# Altium project ESP32_DevBoard_T.PrjPcb
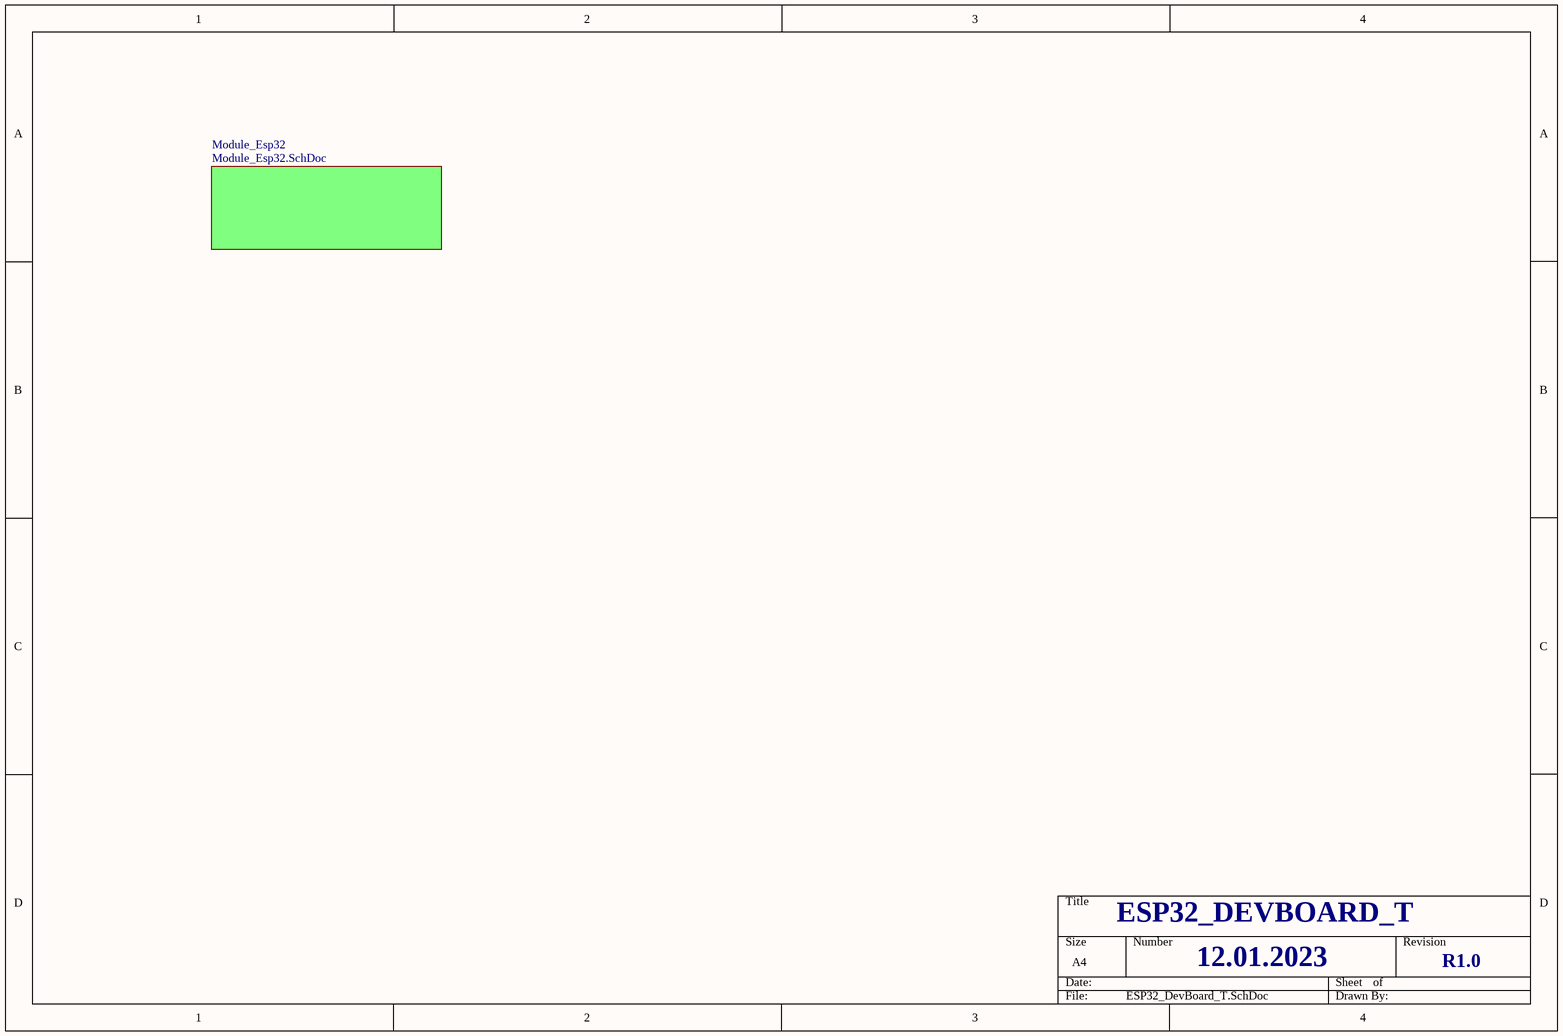
[diagram p0: ESP32_DevBoard_T.SchDoc]
7 sheets, 62 parts. Net scope: flat (ports and power ports of the same name join across sheets).
Board file: ESP32_DevBoard_T.PcbDoc
Sheets:
  ESP32_DevBoard_T.SchDoc
    Module_Esp32 = Module_Esp32.SchDoc
  Input_Analog.SchDoc
  Connector.SchDoc
  Peripheral.SchDoc
  Communication.SchDoc
  Output_Analog.SchDoc

## Sheet ESP32_DevBoard_T.SchDoc
size A4

### Sub-sheets
Module_Esp32 = Module_Esp32.SchDoc: no entries

### Notes on the sheet
- ESP32_DEVBOARD_T
- 12.01.2023
- R1.0

## Sheet Module_Esp32.SchDoc
size A4
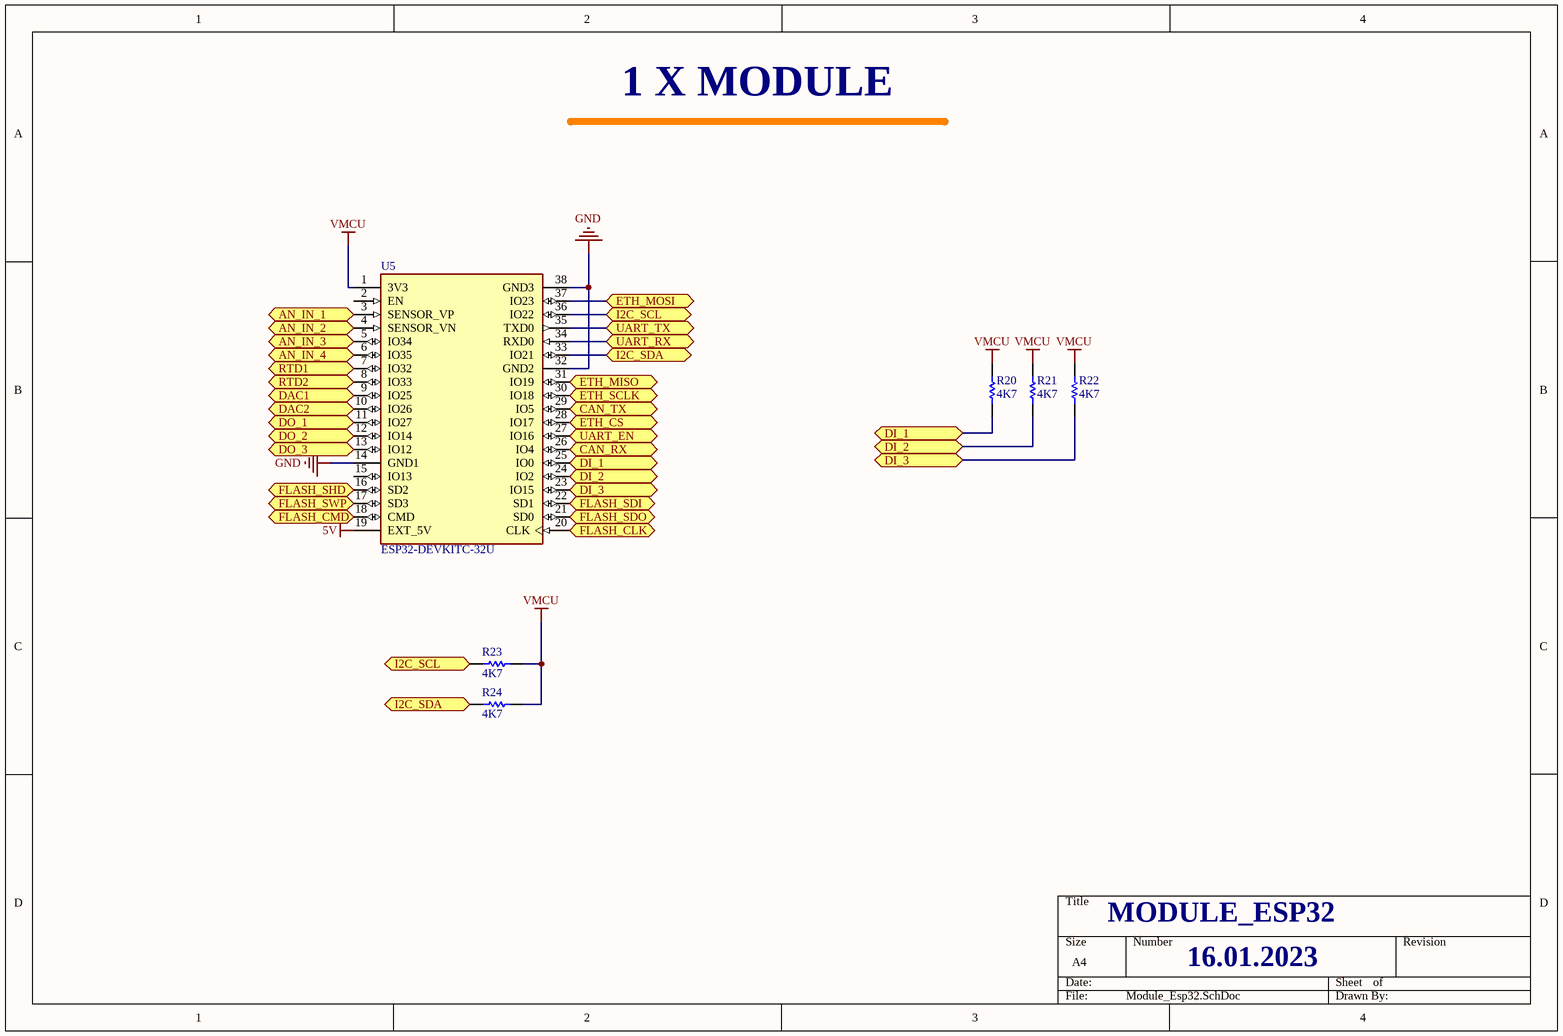
[diagram p1: Module_Esp32.SchDoc]

### Parts
R20  4K7  [RES1608[0603]]
R21  4K7  [RES1608[0603]]
R22  4K7  [RES1608[0603]]
R23  4K7  [RES1608[0603]]
R24  4K7  [RES1608[0603]]
U5  ESP32-DEVKITC-32U  [MODULE_ESP32-DEVKITC-32U]

### Ports
AN_IN_1, AN_IN_2, AN_IN_3, AN_IN_4, CAN_RX, CAN_TX, DAC1, DAC2, DI_1, DI_2, DI_3, DO_1, DO_2, DO_3, ETH_CS, ETH_MISO, ETH_MOSI, ETH_SCLK, FLASH_CLK, FLASH_CMD, FLASH_SDI, FLASH_SDO, FLASH_SHD, FLASH_SWP, I2C_SCL, I2C_SDA, RTD1, RTD2, UART_EN, UART_RX, UART_TX

### Nets
5V: U5.19(EXT_5V)
GND: U5.14(GND1) U5.32(GND2) U5.38(GND3)
VMCU: R20.1 R21.1 R22.1 R23.1 R24.1 U5.1(3V3)
NetC4_1: U5.3(SENSOR_VP) ; port AN_IN_1
NetC5_1: U5.4(SENSOR_VN) ; port AN_IN_2
NetC6_1: U5.7(IO32) ; port RTD1
NetC8_1: U5.8(IO33) ; port RTD2
NetH1_3: U5.37(IO23) ; port ETH_MOSI
NetH1_4: U5.30(IO18) ; port ETH_SCLK
NetH1_5: U5.28(IO17) ; port ETH_CS
NetH1_12: U5.31(IO19) ; port ETH_MISO
NetP2_7: U5.12(IO14) ; port DO_2
NetP2_8: U5.11(IO27) ; port DO_1
NetP2_9: R21.2 U5.24(IO2) ; port DI_2
NetP2_10: U5.13(IO12) ; port DO_3
NetP2_11: R22.2 U5.23(IO15) ; port DI_3
NetP2_12: R20.2 U5.25(IO0) ; port DI_1
NetR23_2: R23.2 U5.36(IO22) ; port I2C_SCL
NetR24_2: R24.2 U5.33(IO21) ; port I2C_SDA
NetR29_1: U5.10(IO26) ; port DAC2
NetR30_1: U5.9(IO25) ; port DAC1
NetU1_1: U5.29(IO5) ; port CAN_TX
NetU1_4: U5.26(IO4) ; port CAN_RX
NetU2_1: U5.34(RXD0) ; port UART_RX
NetU2_2: U5.27(IO16) ; port UART_EN
NetU2_4: U5.35(TXD0) ; port UART_TX
NetU4_1: U5.6(IO35) ; port AN_IN_4
NetU4_6: U5.5(IO34) ; port AN_IN_3
NetU5_16: U5.16(SD2) ; port FLASH_SHD
NetU5_17: U5.17(SD3) ; port FLASH_SWP
NetU5_18: U5.18(CMD) ; port FLASH_CMD
NetU5_20: U5.20(CLK) ; port FLASH_CLK
NetU5_21: U5.21(SD0) ; port FLASH_SDO
NetU5_22: U5.22(SD1) ; port FLASH_SDI

Not connected (* = marked no-connect by the designer): U5 2(EN) 15(IO13)

### Notes on the sheet
- 1 X MODULE
- MODULE_ESP32
- 16.01.2023

### Library data of the parts
R20-R22 = RES: RESISTOR 0805 Case %1; Value: 430R; Published: 8-Jun-2000; LatestRevisionDate: 17-Jul-2002; LatestRevisionNote: Re-released for DXP Platform.; PackageReference: AXIAL-0.5; Publisher: Altium Limited
R23 R24 = RES: RESISTOR 0603 Case %1; Value: 430R; Published: 8-Jun-2000; LatestRevisionDate: 17-Jul-2002; LatestRevisionNote: Re-released for DXP Platform.; PackageReference: AXIAL-0.5; Publisher: Altium Limited
U5 = ESP32-DEVKITC-32U: ESP32-DEVKITC; Availability: Unavailable; MP: ESP32-DEVKITC-32U; Value: *; Package: None; Price: None

## Sheet Input_Analog.SchDoc
size A4
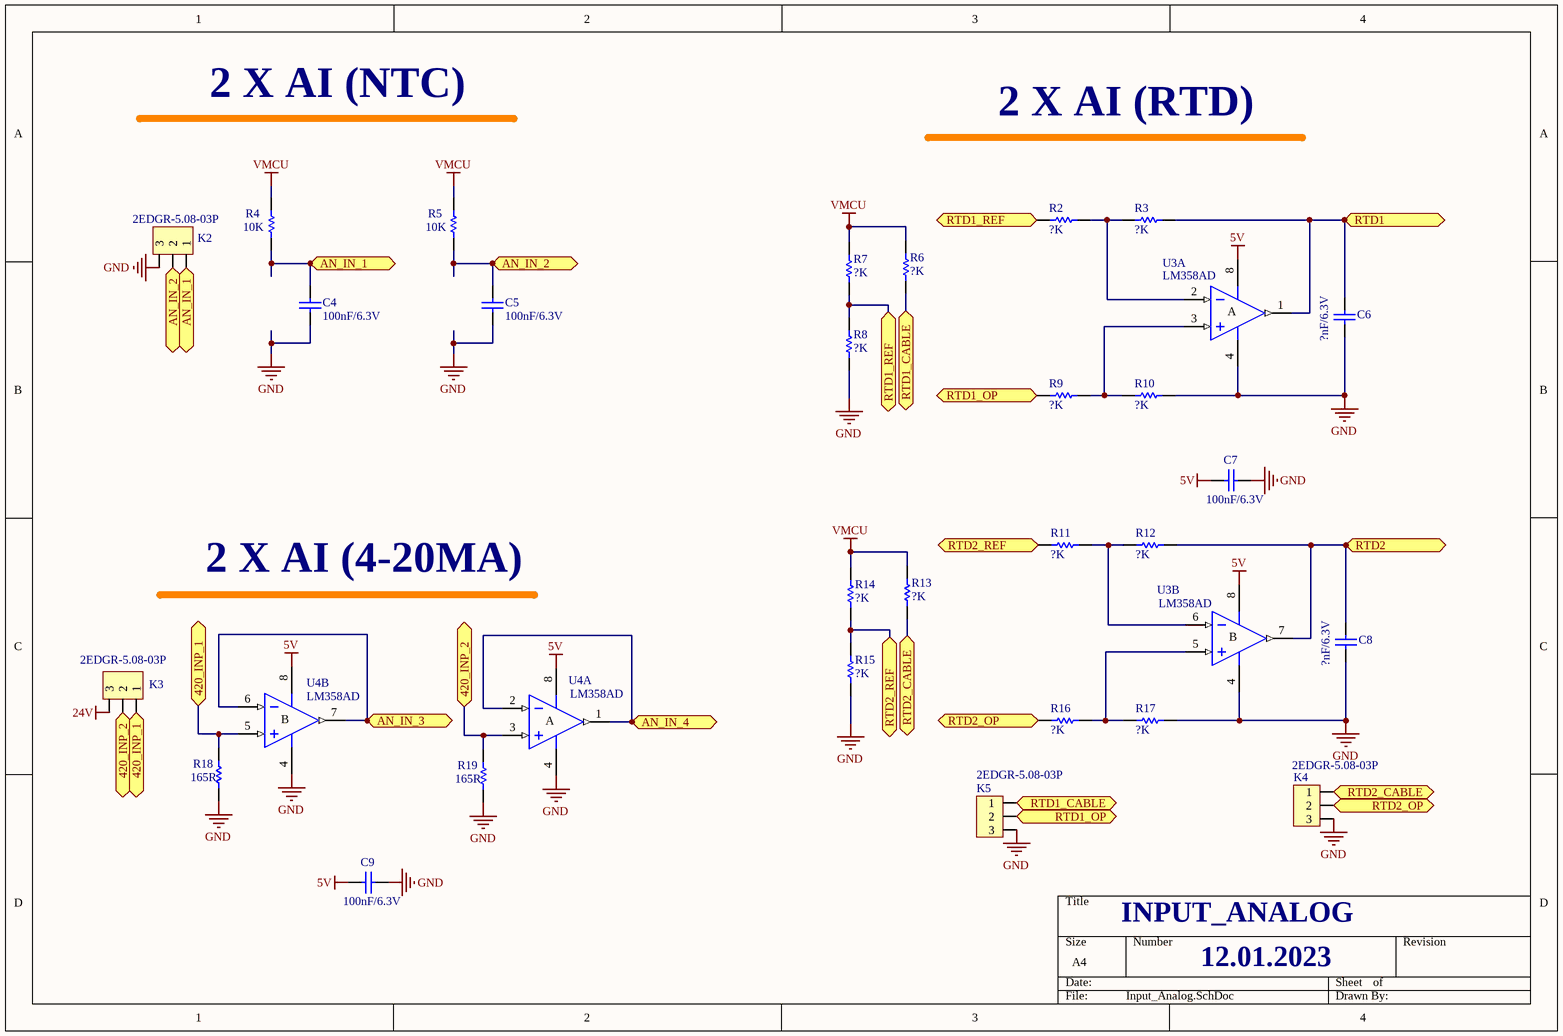
[diagram p2: Input_Analog.SchDoc]

### Parts
C4  100nF/6.3V  [CAP0603W]
C5  100nF/6.3V  [CAP0603W]
C6  ?nF/6.3V  [CAP0603W]
C7  100nF/6.3V  [CAP0603W]
C8  ?nF/6.3V  [CAP0603W]
C9  100nF/6.3V  [CAP0603W]
K2  2EDGR-5.08-03P  [CON_DG129_03P]
K3  2EDGR-5.08-03P  [CON_DG129_03P]
K4  2EDGR-5.08-03P  [CON_DG129_03P]
K5  2EDGR-5.08-03P  [CON_DG129_03P]
R2  ?K  [RES1608[0603]]
R3  ?K  [RES1608[0603]]
R4  10K  [RES1608[0603]]
R5  10K  [RES1608[0603]]
R6  ?K  [RES1608[0603]]
R7  ?K  [RES1608[0603]]
R8  ?K  [RES1608[0603]]
R9  ?K  [RES1608[0603]]
R10  ?K  [RES1608[0603]]
R11  ?K  [RES1608[0603]]
R12  ?K  [RES1608[0603]]
R13  ?K  [RES1608[0603]]
R14  ?K  [RES1608[0603]]
R15  ?K  [RES1608[0603]]
R16  ?K  [RES1608[0603]]
R17  ?K  [RES1608[0603]]
R18  165R  [RES1608[0603]]
R19  165R  [RES1608[0603]]
U3  LM358AD  [SO8]  (parts A,B of 2)
U4  LM358AD  [SO8]  (parts A,B of 2)

### Ports
420_INP_1, 420_INP_2, AN_IN_1, AN_IN_2, AN_IN_3, AN_IN_4, RTD1, RTD1_CABLE, RTD1_OP, RTD1_REF, RTD2, RTD2_CABLE, RTD2_OP, RTD2_REF

### Nets
5V: C7.1 C9.1 U3.8(V+) U4.8(V+)
24V: K3.3
GND: C4.2 C5.2 C6.2 C7.2 C8.2 C9.2 K2.3 K4.3 K5.3 R8.1 R10.1 R15.1 R17.1 R18.2 R19.2 U3.4(V-) U4.4(V-)
VMCU: R4.1 R5.1 R6.2 R7.2 R13.2 R14.2
NetC4_1: C4.1 K2.1 R4.2 ; port AN_IN_1
NetC5_1: C5.1 K2.2 R5.2 ; port AN_IN_2
NetC6_1: C6.1 R3.1 U3.1(OUT) ; port RTD1
NetC8_1: C8.1 R12.1 U3.7(OUT) ; port RTD2
NetK3_1: K3.1 R18.1 U4.5(IN+) ; port 420_INP_1
NetK3_2: K3.2 R19.1 U4.3(IN+) ; port 420_INP_2
NetK4_1: K4.1 R13.1 ; port RTD2_CABLE
NetK4_2: K4.2 R16.2 ; port RTD2_OP
NetK5_1: K5.1 R6.1 ; port RTD1_CABLE
NetK5_2: K5.2 R9.2 ; port RTD1_OP
NetR2_1: R2.1 R3.2 U3.2(IN-)
NetR2_2: R2.2 R7.1 R8.2 ; port RTD1_REF
NetR9_1: R9.1 R10.2 U3.3(IN+)
NetR11_1: R11.1 R12.2 U3.6(IN-)
NetR11_2: R11.2 R14.1 R15.2 ; port RTD2_REF
NetR16_1: R16.1 R17.2 U3.5(IN+)
NetU4_1: U4.1(OUT) U4.2(IN-) ; port AN_IN_4
NetU4_6: U4.6(IN-) U4.7(OUT) ; port AN_IN_3

### Notes on the sheet
- 2 X AI (NTC)
- 2 X AI (RTD)
- 2 X AI (4-20MA)
- INPUT_ANALOG
- 12.01.2023
- (in symbol LM358AD, part A) A
- (in symbol LM358AD, part B) B

### Library data of the parts
C4-C9 = CAP1: CAPACITOR 0603 Case; Value: 100nF; Published: 8-Jun-2000; LatestRevisionDate: 17-Jul-2002; LatestRevisionNote: Re-released for DXP Platform.; PackageReference: C1206; Publisher: Altium Limited
K2-K5 = KLEMENS_3P: CONNECTOR 5.08mm 3PIN 90DEG
R2-R19 = RES: RESISTOR 0603 Case %1; Value: 430R; Published: 8-Jun-2000; LatestRevisionDate: 17-Jul-2002; LatestRevisionNote: Re-released for DXP Platform.; PackageReference: AXIAL-0.5; Publisher: Altium Limited
U3 = LM358AD: OPAMP Low-Power Dual Operational Amplifier; Published: 24-Aug-2001; LatestRevisionDate: 13-Apr-2006; LatestRevisionNote: IPC-7351 Footprint Added.; DatasheetVersion: Jun-1998; PackageVersion: Dec-2002; PackageReference: SO8; Publisher: Altium Limited; PackageDescription: 8-Pin Small Outline Integrated Circuit 1.27 mm Pitch; Code_JEDEC: MS-012-AA; Code_IPC: SOIC127P600-8; ComponentLink1Description: Manufacturer Link; ComponentLink1URL: http://www.st.com/; ComponentLink2Description: Datasheet; ComponentLink2URL: http://www.st.com/stonline/products/literature/ds/2163/lm358.pdf
U4 = LM358AD: Low-Power Dual Operational Amplifier; Published: 24-Aug-2001; LatestRevisionDate: 13-Apr-2006; LatestRevisionNote: IPC-7351 Footprint Added.; DatasheetVersion: Jun-1998; PackageVersion: Dec-2002; PackageReference: SO8; Publisher: Altium Limited; PackageDescription: 8-Pin Small Outline Integrated Circuit 1.27 mm Pitch; Code_JEDEC: MS-012-AA; Code_IPC: SOIC127P600-8; ComponentLink1Description: Manufacturer Link; ComponentLink1URL: http://www.st.com/; ComponentLink2Description: Datasheet; ComponentLink2URL: http://www.st.com/stonline/products/literature/ds/2163/lm358.pdf

## Sheet Connector.SchDoc
size A4
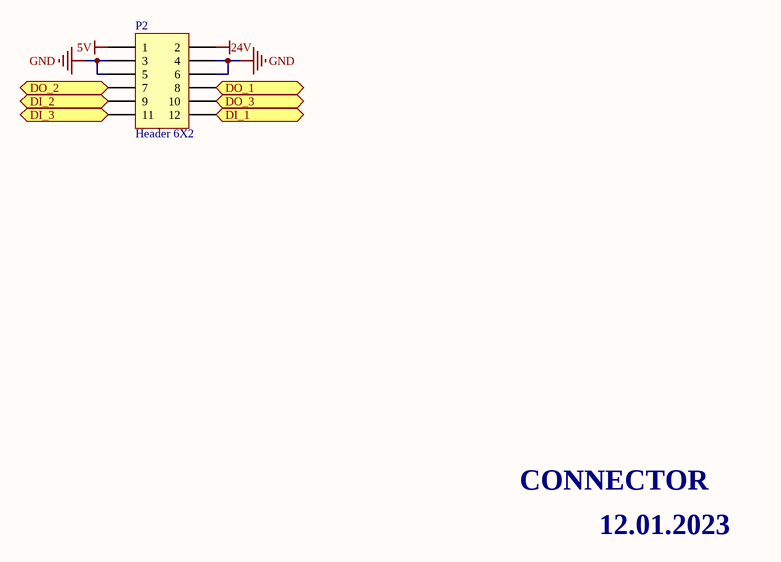
[diagram p3: Connector.SchDoc]

### Parts
P2  Header 6X2  [HDR2X6]

### Ports
DI_1, DI_2, DI_3, DO_1, DO_2, DO_3

### Nets
5V: P2.1
24V: P2.2
GND: P2.3 P2.4 P2.5 P2.6
NetP2_7: P2.7 ; port DO_2
NetP2_8: P2.8 ; port DO_1
NetP2_9: P2.9 ; port DI_2
NetP2_10: P2.10 ; port DO_3
NetP2_11: P2.11 ; port DI_3
NetP2_12: P2.12 ; port DI_1

### Notes on the sheet
- CONNECTOR
- 12.01.2023

### Library data of the parts
P2 = Header 6X2: CONNECTOR Header, 6-Pin, Dual row; LatestRevisionDate: 17-Jul-2002; LatestRevisionNote: Re-released for DXP Platform.; Publisher: Altium Limited

## Sheet Peripheral.SchDoc
size A4
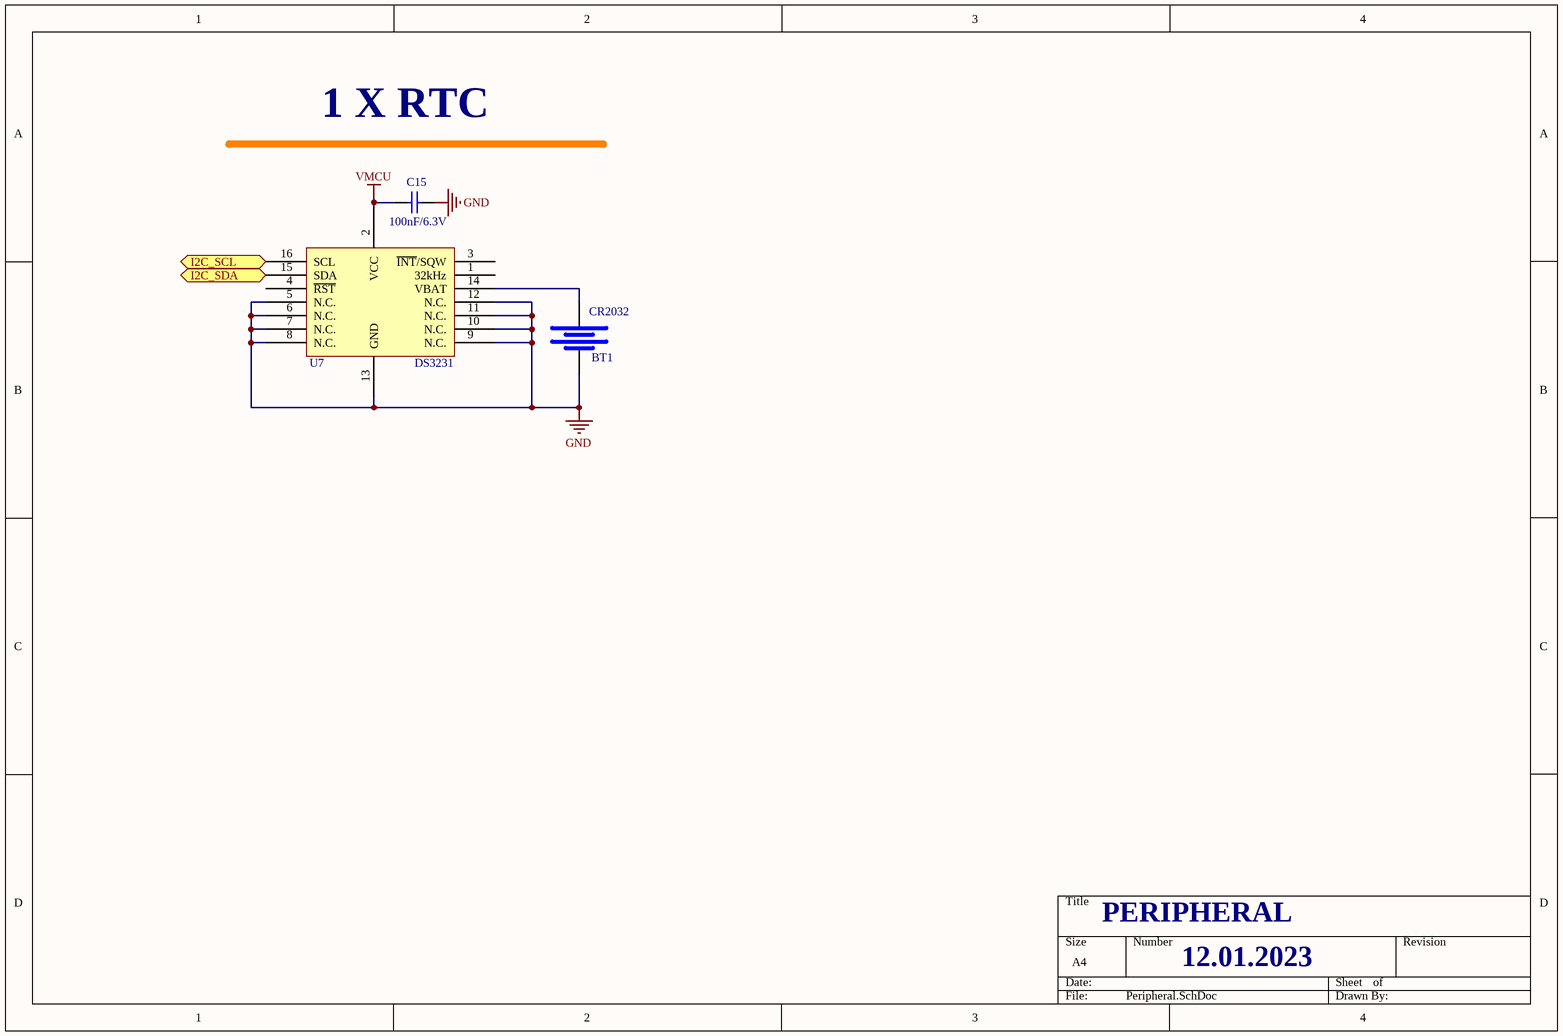
[diagram p4: Peripheral.SchDoc]

### Parts
BT1  CR2032  [CR2032]
C15  100nF/6.3V  [CAP0603W]
U7  DS3231  [SOIC16]

### Ports
I2C_SCL, I2C_SDA

### Nets
GND: BT1.2(-) C15.2 U7.5(N.C.) U7.6(N.C.) U7.7(N.C.) U7.8(N.C.) U7.9(N.C.) U7.10(N.C.) U7.11(N.C.) U7.12(N.C.) U7.13(GND)
VMCU: C15.1 U7.2(VCC)
NetBT1_1: BT1.1(+) U7.14(VBAT)
NetR23_2: U7.16(SCL) ; port I2C_SCL
NetR24_2: U7.15(SDA) ; port I2C_SDA

Not connected (* = marked no-connect by the designer): U7 1(32kHz) 3(~{INT}/SQW) 4(~{RST})

### Notes on the sheet
- 1 X RTC
- PERIPHERAL
- 12.01.2023

### Library data of the parts
BT1 = BATTERY_CR2032: BATTERY CR2032 HORIZONTAL 3PIN
C15 = CAP1: CAPACITOR 0603 Case; Value: 100nF; Published: 8-Jun-2000; LatestRevisionDate: 17-Jul-2002; LatestRevisionNote: Re-released for DXP Platform.; PackageReference: C1206; Publisher: Altium Limited
U7 = RTC_DS3231: IC DS3231SN RTC W/TCXO 16-SOIC MAXIM

## Sheet Communication.SchDoc
size A4
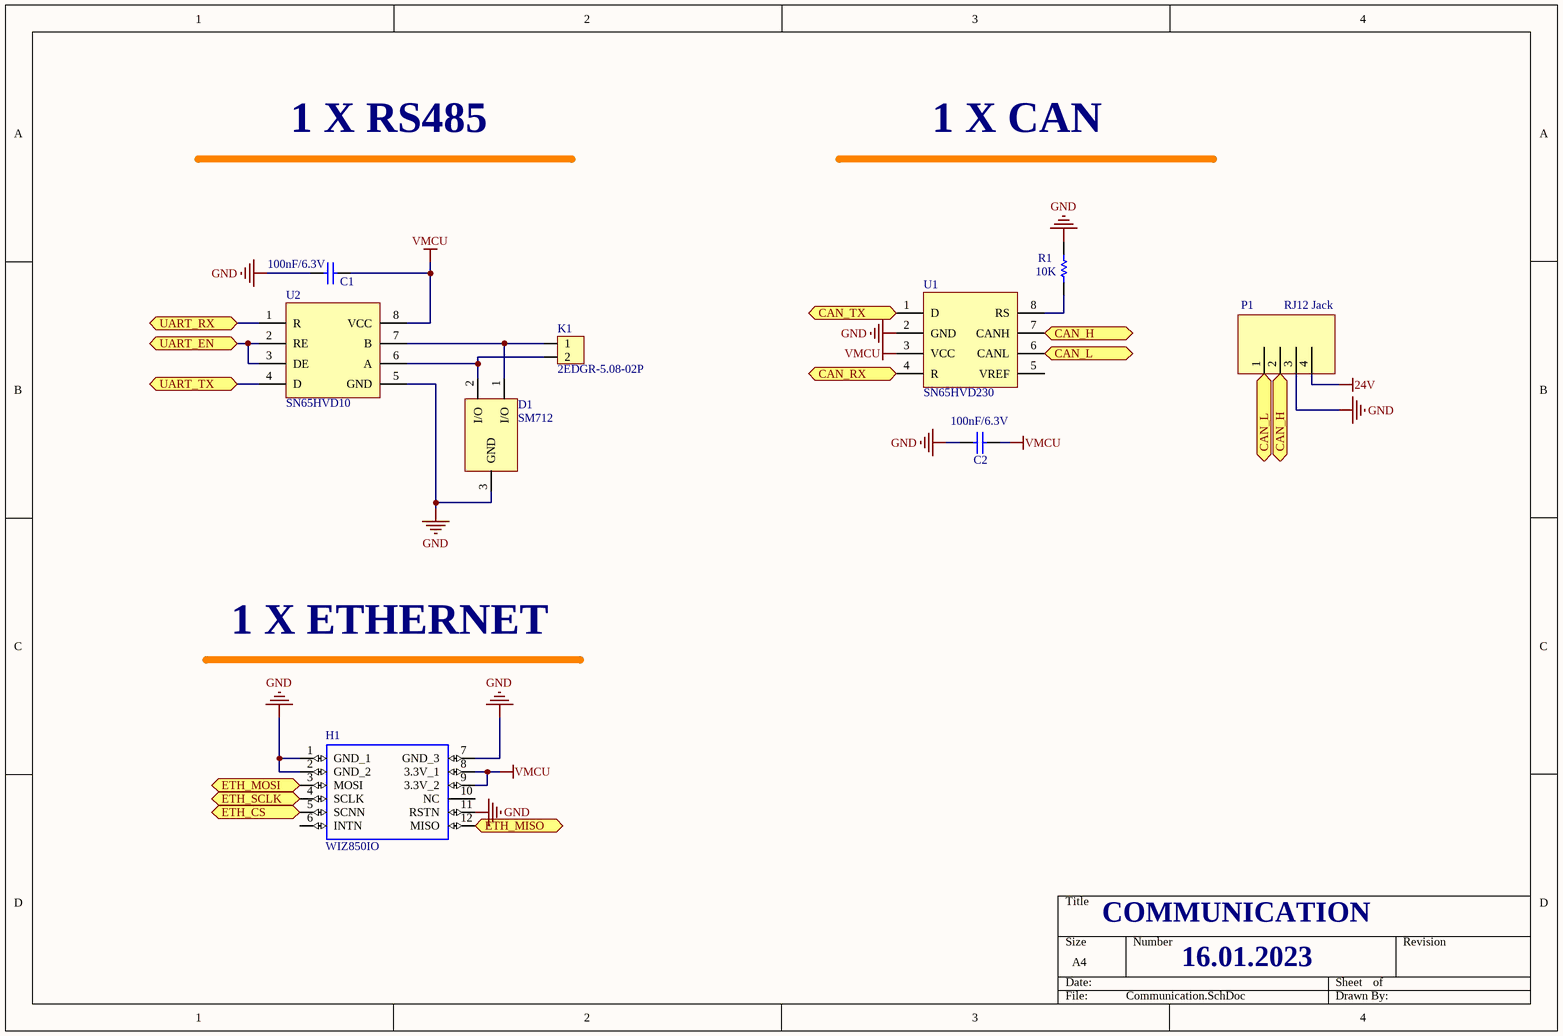
[diagram p5: Communication.SchDoc]

### Parts
C1  100nF/6.3V  [CAP0603W]
C2  100nF/6.3V  [CAP0603W]
D1  SM712  [SOT23 - BC8X6]
H1  WIZ850IO  [WIZ850IO]
K1  2EDGR-5.08-02P  [CON_DG129_02P]
P1  RJ12 Jack  [rj12_90deg_con_4p4c]
R1  10K  [RES1608[0603]]
U1  SN65HVD230  [SO8]
U2  SN65HVD10  [SO8]

### Ports
CAN_H, CAN_L, CAN_RX, CAN_TX, ETH_CS, ETH_MISO, ETH_MOSI, ETH_SCLK, UART_EN, UART_RX, UART_TX

### Nets
24V: P1.4
GND: C1.1 C2.1 D1.3(GND) H1.1(GND_1) H1.2(GND_2) H1.7(GND_3) H1.11(RSTN) P1.3 R1.1 U1.2(GND) U2.5(GND)
VMCU: C1.2 C2.2 H1.8(3.3V_1) H1.9(3.3V_2) U1.3(VCC) U2.8(VCC)
NetD1_1: D1.1(I/O) K1.1 U2.7(B)
NetD1_2: D1.2(I/O) K1.2 U2.6(A)
NetH1_3: H1.3(MOSI) ; port ETH_MOSI
NetH1_4: H1.4(SCLK) ; port ETH_SCLK
NetH1_5: H1.5(SCNN) ; port ETH_CS
NetH1_12: H1.12(MISO) ; port ETH_MISO
NetP1_1: P1.1 U1.6(CANL) ; port CAN_L
NetP1_2: P1.2 U1.7(CANH) ; port CAN_H
NetR1_2: R1.2 U1.8(RS)
NetU1_1: U1.1(D) ; port CAN_TX
NetU1_4: U1.4(R) ; port CAN_RX
NetU2_1: U2.1(R) ; port UART_RX
NetU2_2: U2.2(RE) U2.3(DE) ; port UART_EN
NetU2_4: U2.4(D) ; port UART_TX

Not connected (* = marked no-connect by the designer): H1 6(INTN) 10(NC); U1 5(VREF)

### Notes on the sheet
- 1 X RS485
- 1 X CAN
- 1 X ETHERNET
- COMMUNICATION
- 16.01.2023

### Library data of the parts
C1 C2 = CAP1: CAPACITOR 0603 Case; Value: 100nF; Published: 8-Jun-2000; LatestRevisionDate: 17-Jul-2002; LatestRevisionNote: Re-released for DXP Platform.; PackageReference: C1206; Publisher: Altium Limited
D1 = SM712: DIODE TVS Array For Rs485
H1 = WIZ850IO: Ethernet - 10/100 Base-T/TX PHY SPI Interface Module; MF: WIZnet; Value: *; Package: Module WIZnet; Availability: In Stock; Check_prices: https://www.snapeda.com/parts/WIZ850IO/WIZnet/view-part/?ref=eda; SnapEDA_Link: https://www.snapeda.com/parts/WIZ850IO/WIZnet/view-part/?ref=snap; Purchase-URL: https://pricing.snapeda.com/search/part/WIZ850IO/?ref=eda; MP: WIZ850IO; Price: None
K1 = KLEMENS_2P: CONNECTOR 5.08mm 2PIN 90DEG
P1 = RJ12_4P4C: CONNECTOR RJ12 Jack, 90 Degree
R1 = RES: RESISTOR 0603 Case %1; Value: 430R; Published: 8-Jun-2000; LatestRevisionDate: 17-Jul-2002; LatestRevisionNote: Re-released for DXP Platform.; PackageReference: AXIAL-0.5; Publisher: Altium Limited
U1 = SN65HVD230: CAN Interface IC 3.3V CAN Transceiver; Published: 24-Aug-2001; LatestRevisionDate: 6-Jun-2005; LatestRevisionNote: Stylized 3D Model Added.; DatasheetDocument: Feb-1998; PackageDocument: Aug-1999; PackageReference: SO8W; Publisher: Altium Limited; ComponentLink1Description: Manufacturer Link; ComponentLink1URL: http://www.st.com/
U2 = 75176: IC SN65HVD10DR SMD SOIC8; Published: 24-Aug-2001; LatestRevisionDate: 6-Jun-2005; LatestRevisionNote: Stylized 3D Model Added.; DatasheetDocument: Feb-1998; PackageDocument: Aug-1999; PackageReference: SO8W; Publisher: Altium Limited; ComponentLink1Description: Manufacturer Link; ComponentLink1URL: http://www.st.com/

## Sheet Output_Analog.SchDoc
size A4
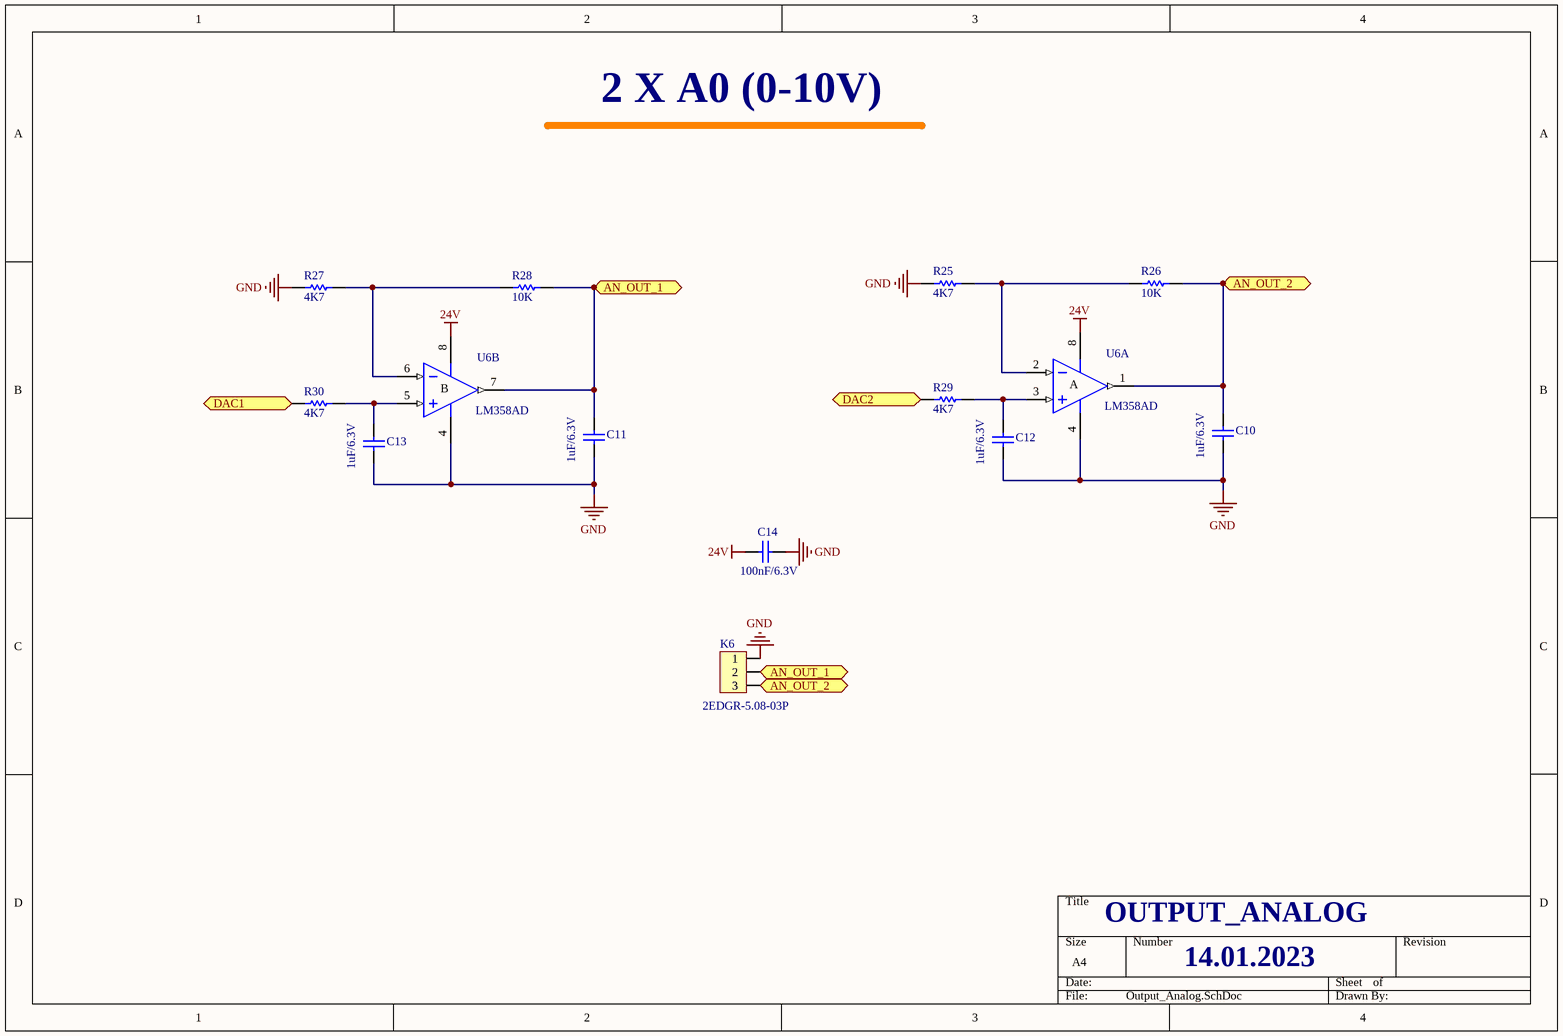
[diagram p6: Output_Analog.SchDoc]

### Parts
C10  1uF/6.3V  [CAP0603W]
C11  1uF/6.3V  [CAP0603W]
C12  1uF/6.3V  [CAP0603W]
C13  1uF/6.3V  [CAP0603W]
C14  100nF/6.3V  [CAP0603W]
K6  2EDGR-5.08-03P  [CON_DG129_03P]
R25  4K7  [RES1608[0603]]
R26  10K  [RES1608[0603]]
R27  4K7  [RES1608[0603]]
R28  10K  [RES1608[0603]]
R29  4K7  [RES1608[0603]]
R30  4K7  [RES1608[0603]]
U6  LM358AD  [SO8]  (parts A,B of 2)

### Ports
AN_OUT_1, AN_OUT_2, DAC1, DAC2

### Nets
24V: C14.1 U6.8(V+)
GND: C10.1 C11.1 C12.1 C13.1 C14.2 K6.1 R25.1 R27.1 U6.4(V-)
NetC10_2: C10.2 K6.3 R26.2 U6.1(OUT) ; port AN_OUT_2
NetC11_2: C11.2 K6.2 R28.2 U6.7(OUT) ; port AN_OUT_1
NetC12_2: C12.2 R29.2 U6.3(IN+)
NetC13_2: C13.2 R30.2 U6.5(IN+)
NetR25_2: R25.2 R26.1 U6.2(IN-)
NetR27_2: R27.2 R28.1 U6.6(IN-)
NetR29_1: R29.1 ; port DAC2
NetR30_1: R30.1 ; port DAC1

### Notes on the sheet
- 2 X A0 (0-10V)
- OUTPUT_ANALOG
- 14.01.2023
- (in symbol LM358AD, part A) A
- (in symbol LM358AD, part B) B

### Library data of the parts
C10-C14 = CAP1: CAPACITOR 0603 Case; Value: 100nF; Published: 8-Jun-2000; LatestRevisionDate: 17-Jul-2002; LatestRevisionNote: Re-released for DXP Platform.; PackageReference: C1206; Publisher: Altium Limited
K6 = KLEMENS_3P: CONNECTOR 5.08mm 3PIN 90DEG
R25-R30 = RES: RESISTOR 0603 Case %1; Value: 430R; Published: 8-Jun-2000; LatestRevisionDate: 17-Jul-2002; LatestRevisionNote: Re-released for DXP Platform.; PackageReference: AXIAL-0.5; Publisher: Altium Limited
U6 = LM358AD: as U3 on sheet Input_Analog; Published: 24-Aug-2001; LatestRevisionDate: 13-Apr-2006; LatestRevisionNote: IPC-7351 Footprint Added.; DatasheetVersion: Jun-1998; PackageVersion: Dec-2002; PackageReference: SO8; Publisher: Altium Limited; PackageDescription: 8-Pin Small Outline Integrated Circuit 1.27 mm Pitch; Code_JEDEC: MS-012-AA; Code_IPC: SOIC127P600-8; ComponentLink1Description: Manufacturer Link; ComponentLink1URL: http://www.st.com/; ComponentLink2Description: Datasheet; ComponentLink2URL: http://www.st.com/stonline/products/literature/ds/2163/lm358.pdf

## Nets that join several sheets
5V: Module_Esp32 (U5.19), Input_Analog (C7.1 C9.1 U3.8 U4.8), Connector (P2.1)
24V: Input_Analog (K3.3), Connector (P2.2), Communication (P1.4), Output_Analog (C14.1 U6.8)
GND: Module_Esp32 (U5.14 U5.32 U5.38), Input_Analog (17 pins), Connector (P2.3 P2.4 P2.5 P2.6), Peripheral (11 pins), Communication (11 pins), Output_Analog (9 pins)
VMCU: Module_Esp32 (6 pins), Input_Analog (6 pins), Peripheral (C15.1 U7.2), Communication (6 pins)
NetC4_1: Module_Esp32 (U5.3), Input_Analog (C4.1 K2.1 R4.2)
NetC5_1: Module_Esp32 (U5.4), Input_Analog (C5.1 K2.2 R5.2)
NetC6_1: Module_Esp32 (U5.7), Input_Analog (C6.1 R3.1 U3.1)
NetC8_1: Module_Esp32 (U5.8), Input_Analog (C8.1 R12.1 U3.7)
NetH1_3: Module_Esp32 (U5.37), Communication (H1.3)
NetH1_4: Module_Esp32 (U5.30), Communication (H1.4)
NetH1_5: Module_Esp32 (U5.28), Communication (H1.5)
NetH1_12: Module_Esp32 (U5.31), Communication (H1.12)
NetP2_7: Module_Esp32 (U5.12), Connector (P2.7)
NetP2_8: Module_Esp32 (U5.11), Connector (P2.8)
NetP2_9: Module_Esp32 (R21.2 U5.24), Connector (P2.9)
NetP2_10: Module_Esp32 (U5.13), Connector (P2.10)
NetP2_11: Module_Esp32 (R22.2 U5.23), Connector (P2.11)
NetP2_12: Module_Esp32 (R20.2 U5.25), Connector (P2.12)
NetR23_2: Module_Esp32 (R23.2 U5.36), Peripheral (U7.16)
NetR24_2: Module_Esp32 (R24.2 U5.33), Peripheral (U7.15)
NetR29_1: Module_Esp32 (U5.10), Output_Analog (R29.1)
NetR30_1: Module_Esp32 (U5.9), Output_Analog (R30.1)
NetU1_1: Module_Esp32 (U5.29), Communication (U1.1)
NetU1_4: Module_Esp32 (U5.26), Communication (U1.4)
NetU2_1: Module_Esp32 (U5.34), Communication (U2.1)
NetU2_2: Module_Esp32 (U5.27), Communication (U2.2 U2.3)
NetU2_4: Module_Esp32 (U5.35), Communication (U2.4)
NetU4_1: Module_Esp32 (U5.6), Input_Analog (U4.1 U4.2)
NetU4_6: Module_Esp32 (U5.5), Input_Analog (U4.6 U4.7)